# Altium schematic sheet Power_Supply.SchDoc
size A; SheetNumber: 1; SheetTotal: 1
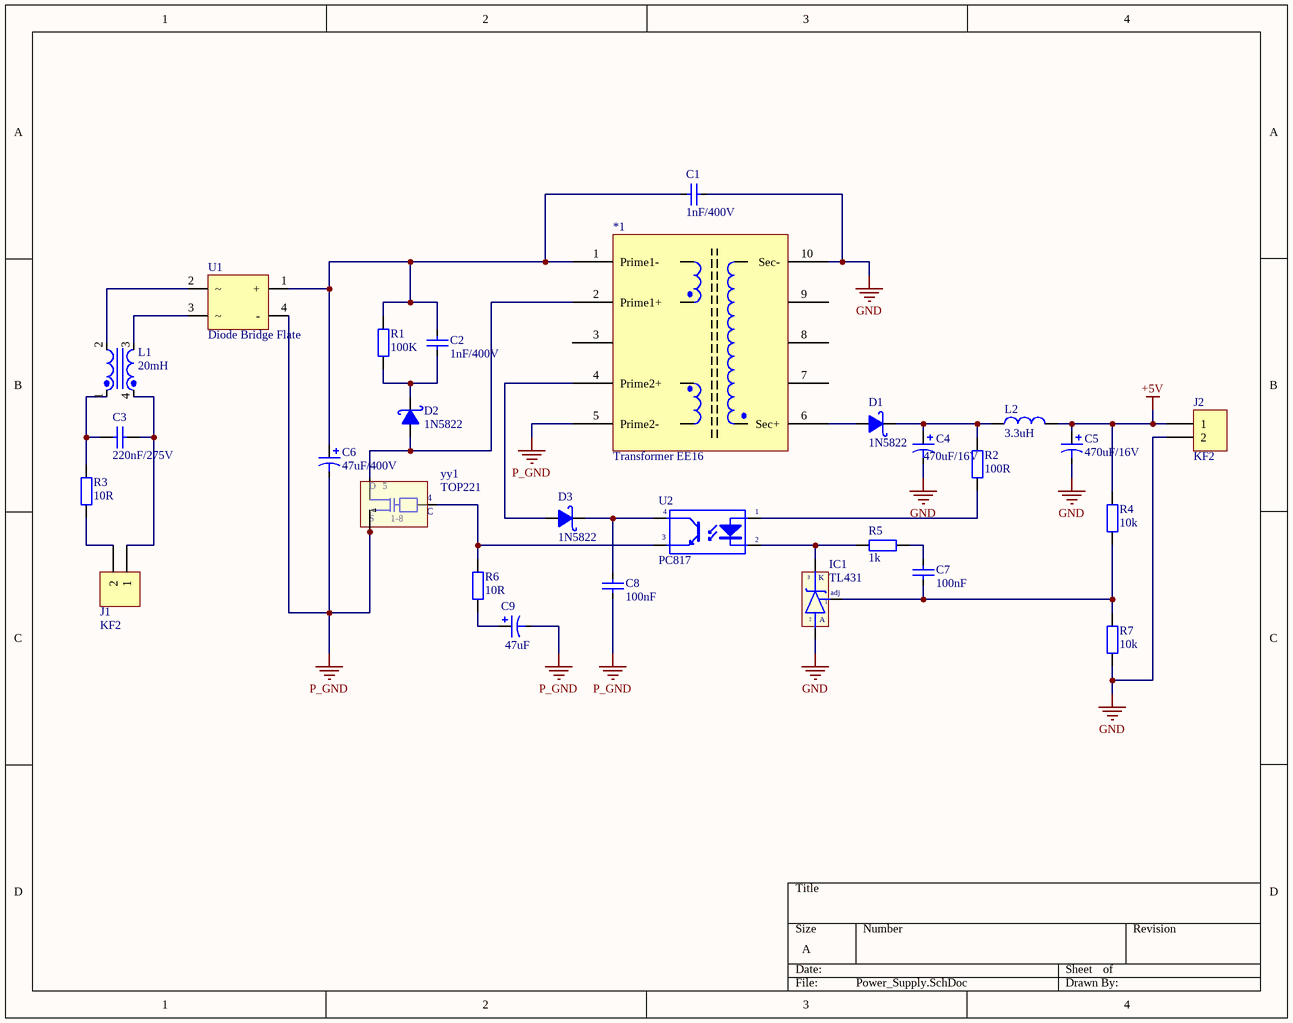
[diagram p0: Power_Supply.SchDoc]

## Parts
*1  Transformer EE16  [Transformer SW]
C1  1nF/400V  [103/2KV]
C2  1nF/400V  [103/2KV]
C3  value 220nF/275V  [CN3]  (hidden comment: Capacitor Ceramic)
C4  470uF/16V  [C5mm]
C5  470uF/16V  [C5mm]
C6  47uF/400V  [C10mm]
C7  100nF  [103/2KV]
C8  100nF  [103/2KV]
C9  47uF  [C3MM]
D1  1N5822  [DO-214AC(SMA)]
D2  1N5822  [DO-214AC(SMA)]
D3  1N5822  [DO-214AC(SMA)]
IC1  TL431  [qto-92]
J1  KF2  [KF2-5.08]
J2  KF2  [KF2-5.08]
L1  20mH  [InductorFilter]
L2  3.3uH  [L-SMD-M-12x10]
R1  100K  [RES-1WD]
R2  100R  [SM-0805]
R3  10R  [RES-1WD]
R4  10k  [SM-0805]
R5  1k  [SM-0805]
R6  10R  [SM-0805]
R7  10k  [SM-0805]
U1  Diode Bridge Flate  [CAU 1A]
U2  PC817  [DIP4/W0.3]
yy1  TOP221  [DIP8/W0.3]

## Nets
+5V: C5.1 J2.1 L2.2 R4.1
GND: *1.10(Sec-) C1.1 C4.2 C5.2 IC1.2(A) J2.2 R7.2
P_GND: *1.5(Prime2-) C6.2 C8.1 C9.2 U1.4(-) yy1.1(S) yy1.2(S) yy1.3(S) yy1.6(S) yy1.7(S) yy1.8(S)
Net*1_1: *1.1(Prime1-) C1.2 C2.2 C6.1 R1.2 U1.1(+)
Net*1_2: *1.2(Prime1+) D2.1(A) yy1.5(D)
Net*1_4: *1.4(Prime2+) D3.1(A)
Net*1_6: *1.6(Sec+) D1.1(A)
NetC2_1: C2.1 D2.2(K) R1.1
NetC3_1: C3.1 L1.1 R3.2
NetC3_2: C3.2 J1.1 L1.4
NetC4_1: C4.1 D1.2(K) L2.1 R2.2
NetC7_1: C7.1 IC1.1(adj) R4.2 R7.1
NetC7_2: C7.2 R5.1
NetC8_2: C8.2 D3.2(K) U2.4(C)
NetC9_1: C9.1 R6.1
NetIC1_3: IC1.3(K) R5.2 U2.2(K)
NetJ1_2: J1.2 R3.1
NetL1_2: L1.2 U1.2
NetL1_3: L1.3 U1.3
NetR2_1: R2.1 U2.1(A)
NetR6_2: R6.2 U2.3(E) yy1.4(C)

Not connected (* = marked no-connect by the designer): *1 3 7 8 9

## Notes on the sheet
- (in symbol TOP221-7PG) 1-8

## Library data of the parts
C1 C2 C7 C8 = Cap2KV: Capacitor Ceramic 2KV; Published: 8-Jun-2000; LatestRevisionDate: 17-Jul-2002; LatestRevisionNote: Re-released for DXP Platform.; PackageReference: RAD-0.3; Publisher: Altium Limited
C3 = CapCeramic: Capacitor; Published: 8-Jun-2000; LatestRevisionDate: 17-Jul-2002; LatestRevisionNote: Re-released for DXP Platform.; PackageReference: RAD-0.3; Publisher: Altium Limited
C4-C6 C9 = Cap Pol: Polarized Capacitor (Axial); Published: 8-Jun-2000; LatestRevisionDate: 17-Jul-2002; LatestRevisionNote: Re-released for DXP Platform.; PackageReference: POLAR0.8; Publisher: Altium Limited
D1-D3 = 1N5822: Schottky Rectifiers; Value: Diode c?m 1N5408
IC1 = TL431: Programmable Shunt Regulator; Value: TL431
J1 J2 = KF2: Manufacturer: Würth Elektronik eiSos GmbH; partNo: 691103110002; ComponentLink1 Description: Manufacturer; ComponentLink2 Description: Datasheet; NoPins: 2; Created Date: 29 October 2013; ComponentLink1URL: http://www.we-online.com; ComponentLink2URL: http://katalog.we-online.de/em/datasheet/6911031100xx.pdf; Created by: Karrer Zheng
L1 = L fiter: Inductor; Value: Loc 220; Designed by: VanDungEvn
L2 = Inductor: Value: 150 mH
R1-R4 R6 R7 = RM: Resistor SMD; Value: 1K
R5 = RM: Resistor SMD; Value: 1K
U1 = Diode Bridge Flate: Diode Bridge
U2 = PC817: Single Opto; Value: PC817
yy1 = TOP221-7PG: Family Three-terminal Off-line PWM Switch